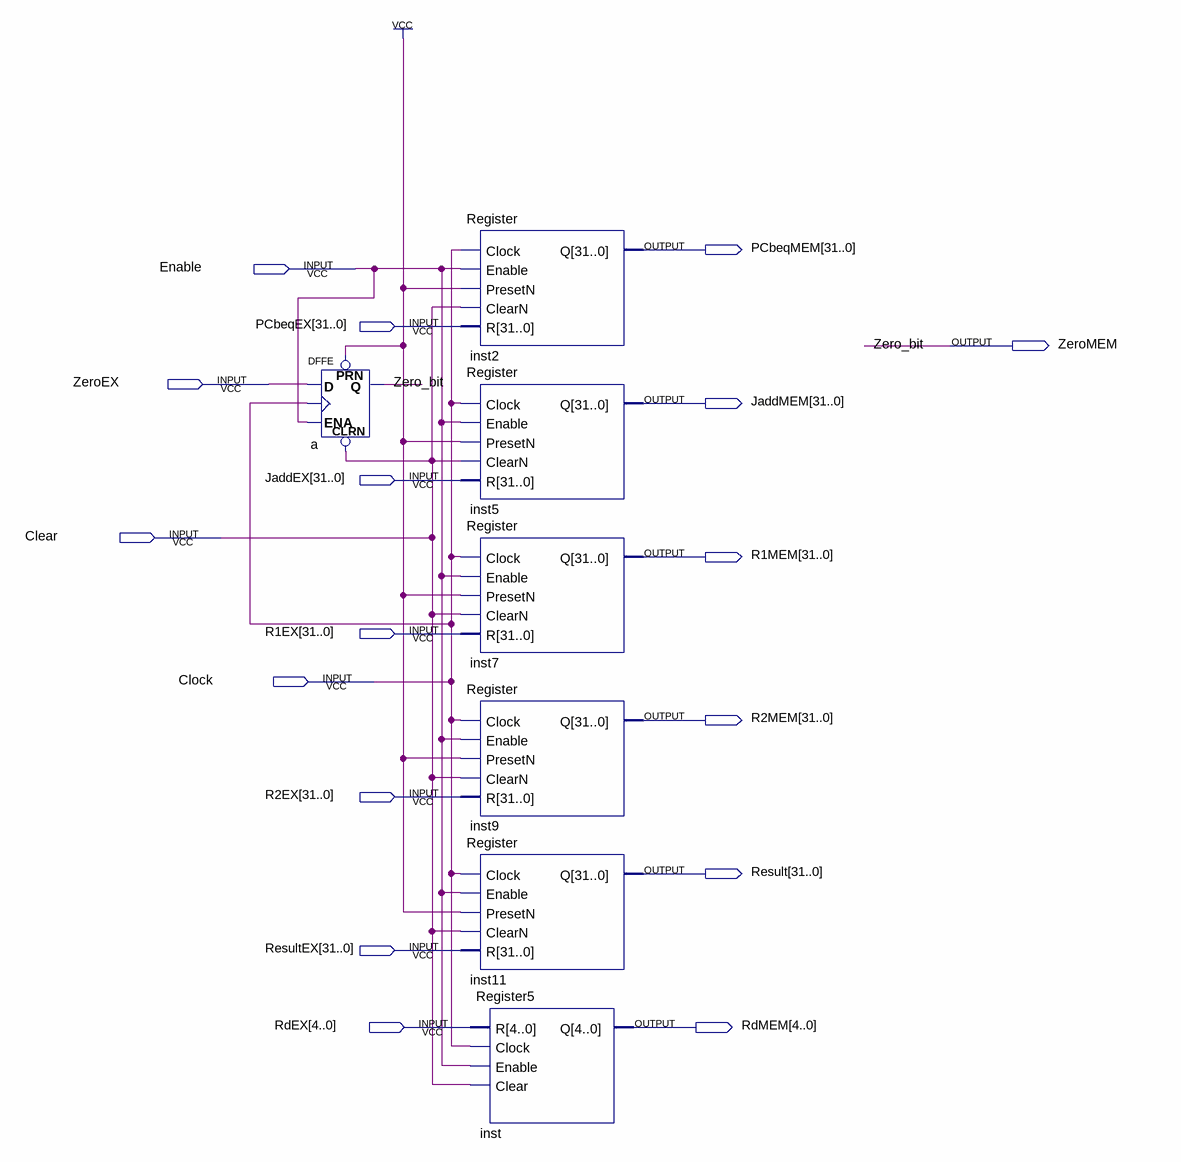
[diagram p0: schematic sheet]
// Quartus schematic BarreiraEXMEM.bdf as structural Verilog: 7 symbols, 17 pins
module BarreiraEXMEM (
  input  Enable,
  input  [31:0] PCbeqEX,
  input  ZeroEX,
  input  [31:0] JaddEX,
  input  Clear,
  input  [31:0] R1EX,
  input  Clock,
  input  [31:0] R2EX,
  input  [31:0] ResultEX,
  input  [4:0] RdEX,
  output [31:0] PCbeqMEM,
  output ZeroMEM,
  output [31:0] JaddMEM,
  output [31:0] R1MEM,
  output [31:0] R2MEM,
  output [31:0] Result,
  output [4:0] RdMEM
);

  DFFE a (.PRN(1'b1), .CLRN(Clear), .D(ZeroEX), .CLK(Clock), .ENA(Enable), .Q(ZeroMEM));
  Register inst2 (.Clock(Clock), .Enable(Enable), .PresetN(1'b1), .ClearN(Clear), .R(PCbeqEX), .Q(PCbeqMEM));
  Register inst5 (.Clock(Clock), .Enable(Enable), .PresetN(1'b1), .ClearN(Clear), .R(JaddEX), .Q(JaddMEM));
  Register inst7 (.Clock(Clock), .Enable(Enable), .PresetN(1'b1), .ClearN(Clear), .R(R1EX), .Q(R1MEM));
  Register inst9 (.Clock(Clock), .Enable(Enable), .PresetN(1'b1), .ClearN(Clear), .R(R2EX), .Q(R2MEM));
  Register inst11 (.Clock(Clock), .Enable(Enable), .PresetN(1'b1), .ClearN(Clear), .R(ResultEX), .Q(Result));
  Register5 inst (.R(RdEX), .Clock(Clock), .Enable(Enable), .Clear(Clear), .Q(RdMEM));

  // Other names for the same wires on the sheet: Zero_bit = ZeroMEM
endmodule
